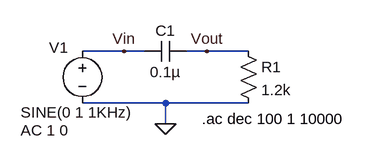
[diagram p0: schematic HighPass.asc]
HighPass.asc, the LTspice schematic file:
Version 4
SHEET 1 880 680
WIRE 144 80 80 80
WIRE 176 80 144 80
WIRE 272 80 240 80
WIRE 336 80 272 80
WIRE 208 160 80 160
WIRE 336 160 208 160
WIRE 208 192 208 160
FLAG 208 192 0
FLAG 272 80 Vout
FLAG 144 80 Vin
SYMBOL cap 240 64 R90
WINDOW 0 0 32 VBottom 2
WINDOW 3 32 32 VTop 2
SYMATTR InstName C1
SYMATTR Value 0.1µ
SYMBOL res 320 64 R0
SYMATTR InstName R1
SYMATTR Value 1.2k
SYMBOL voltage 80 64 R0
WINDOW 0 -51 10 Left 2
WINDOW 3 -95 110 Left 2
WINDOW 123 -95 138 Left 2
WINDOW 39 0 0 Left 0
SYMATTR InstName V1
SYMATTR Value SINE(0 1 1KHz)
SYMATTR Value2 AC 1 0
TEXT 264 184 Left 2 !.ac dec 100 1 10000

The netlist it stands for:
* HighPass.asc
C1 Vout Vin 0.1µ
R1 Vout 0 1.2k
V1 Vin 0 SINE(0 1 1KHz) AC 1 0
.ac dec 100 1 10000
.backanno
.end